# Altium schematic sheet SCH_WINGLET_WIFI.SchDoc: Winglet Wi-Fi
size B; DrawnBy: HCAdam; Organization: Aerospace Village; DocumentNumber: WINGLET; Revision: A; SheetNumber: 6; SheetTotal: 10
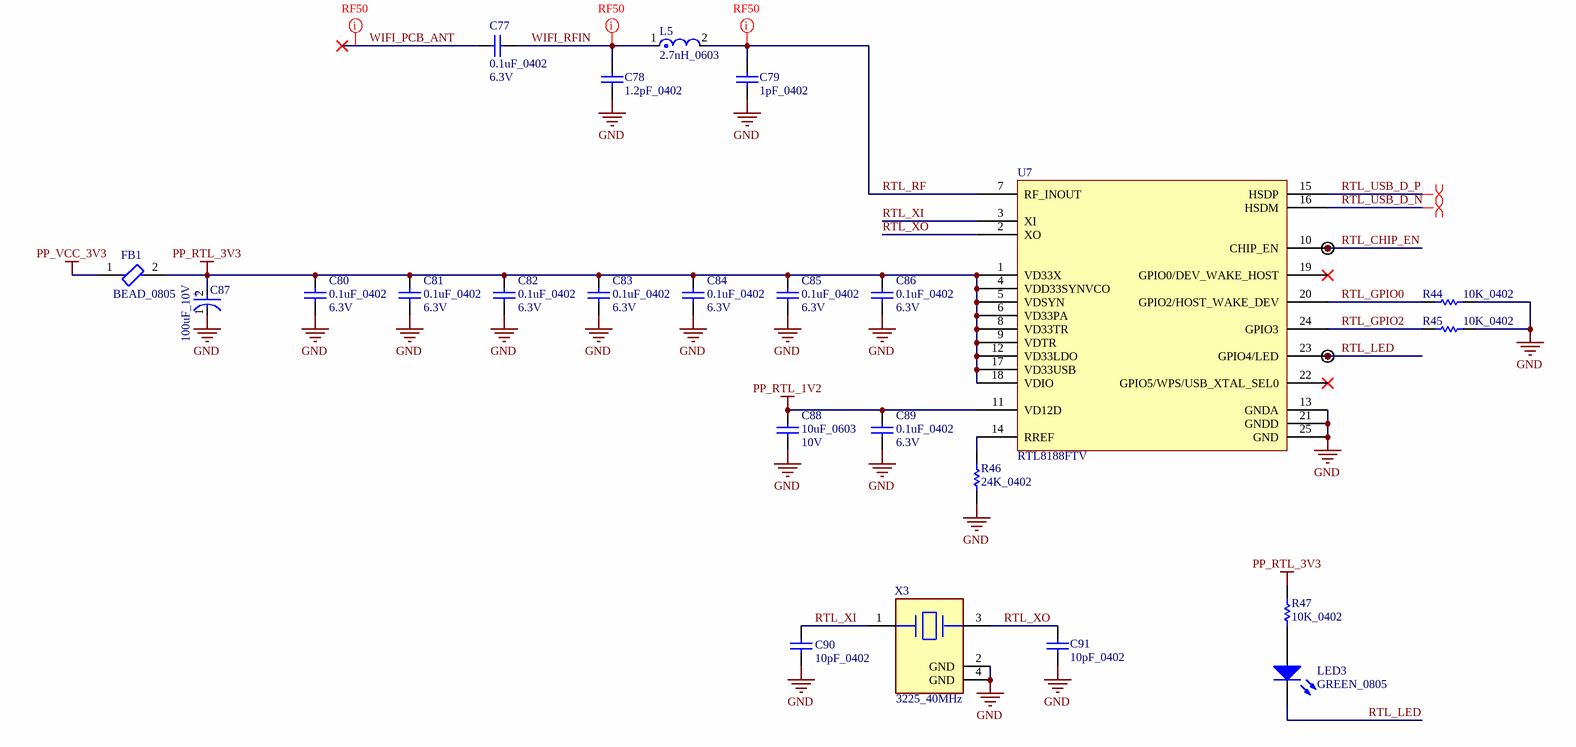
[diagram p0: SCH_WINGLET_WIFI.SchDoc]

## Parts
C77  0.1uF_0402  Voltage Rating: 6.3V  [CAPC1005X56X25NL10T15]
C78  1.2pF_0402  [CAPC1005X61X26NL10T16]
C79  1pF_0402  [CAPC1005X56X25NL10T15]
C80  0.1uF_0402  Voltage Rating: 6.3V  [CAPC1005X56X25NL10T15]
C81  0.1uF_0402  Voltage Rating: 6.3V  [CAPC1005X56X25NL10T15]
C82  0.1uF_0402  Voltage Rating: 6.3V  [CAPC1005X56X25NL10T15]
C83  0.1uF_0402  Voltage Rating: 6.3V  [CAPC1005X56X25NL10T15]
C84  0.1uF_0402  Voltage Rating: 6.3V  [CAPC1005X56X25NL10T15]
C85  0.1uF_0402  Voltage Rating: 6.3V  [CAPC1005X56X25NL10T15]
C86  0.1uF_0402  Voltage Rating: 6.3V  [CAPC1005X56X25NL10T15]
C87  100uF_10V  [FP-TAJB-MFG]
C88  10uF_0603  Voltage Rating: 10V  [CAPC1609X100X15NL20]
C89  0.1uF_0402  Voltage Rating: 6.3V  [CAPC1005X56X25NL10T15]
C90  10pF_0402  [CAPC1006X50X20NL10T10]
C91  10pF_0402  [CAPC1006X50X20NL10T10]
FB1  BEAD_0805  [FP-BLM21-0_2-t0_85-e0_5-IPC_B]
L5  2.7nH_0603  [FP-LQG18HH_00-IPC_B]
LED3  GREEN_0805  [0805_A]
R44  10K_0402  [RESC1005X40X25NL05T05]
R45  10K_0402  [RESC1005X40X25NL05T05]
R46  24K_0402  [RESC1005X40X25NL05T05]
R47  10K_0402  [RESC1005X40X25NL05T05]
TP25  TESTPOINT  [TESTPOINT-0.7MM-SINGLE-LAYER]  (value not drawn)  (no BOM)
TP26  TESTPOINT  [TESTPOINT-0.7MM-SINGLE-LAYER]  (value not drawn)  (no BOM)
U7  RTL8188FTV  [QFN50P400X400X90_HS-25N_RTL]
X3  3225_40MHz  [FP-ABM8-MFG]

## Nets
GND: C78.1 C79.1 C80.1 C81.1 C82.1 C83.1 C84.1 C85.1 C86.1 C87.1(C) C88.1 C89.1 C90.1 C91.1 R44.1 R45.1 R46.1 U7.13(GNDA) U7.21(GNDD) U7.25(GND) X3.2(GND) X3.4(GND)
PP_RTL_1V2: C88.2 C89.2 U7.11(VD12D)
PP_RTL_3V3: C80.2 C81.2 C82.2 C83.2 C84.2 C85.2 C86.2 C87.2(A) FB1.2 R47.1 U7.1(VD33X) U7.4(VDD33SYNVCO) U7.5(VDSYN) U7.6(VD33PA) U7.8(VD33TR) U7.9(VDTR) U7.12(VD33LDO) U7.17(VD33USB) U7.18(VDIO)
PP_VCC_3V3: FB1.1
RTL_CHIP_EN: TP25.1 U7.10(CHIP_EN)
RTL_GPIO0: R44.2 U7.20(GPIO2/HOST_WAKE_DEV)
RTL_GPIO2: R45.2 U7.24(GPIO3)
RTL_LED: LED3.1(K) TP26.1 U7.23(GPIO4/LED)
RTL_RF: C79.2 L5.2 U7.7(RF_INOUT)
RTL_USB_D_N: U7.16(HSDM)
RTL_USB_D_P: U7.15(HSDP)
RTL_XI: C90.2 U7.3(XI) X3.1
RTL_XO: C91.2 U7.2(XO) X3.3
WIFI_PCB_ANT: C77.2
WIFI_RFIN: C77.1 C78.2 L5.1
NetLED3_2: LED3.2(A) R47.2
NetR46_2: R46.2 U7.14(RREF)

Not connected (* = marked no-connect by the designer): U7 19(GPIO0/DEV_WAKE_HOST)* 22(GPIO5/WPS/USB_XTAL_SEL0)*

## Layout directives
differential pair: RTL_USB_D_N, RTL_USB_D_P
net class RF_50Z: RTL_RF, WIFI_PCB_ANT, WIFI_RFIN

## Notes on the sheet
- Title
- Size:
- Date:
- B
- Project:
- Revision:
- Sheet
- of
- Drawn By:
- (in symbol CMP-04424-000366-1) +

## Library data of the parts
C77 C80-C86 C89 = CMP-2008-02743-1: 04026D104KAT2A; Manufacturer: AVX Interconnect / Elco; Part Number: 04026D104KAT2A
C78 = CMP-2008-01995-1: VJ0402D1R0BXCAJ; Manufacturer: Vitramon; Part Number: VJ0402D1R0BXCAJ
C79 = CMP-1034-00084-2: 04025A1R2BAT2A; Manufacturer: AVX Interconnect / Elco; Part Number: 04025A1R2BAT2A
C87 = CMP-04424-000366-1: 100uF 10V ±10% 1.7Ω SMD CASE-B (3528) Tantalum Capacitor; Voltage Rating (DC): 6.3V; ESR (Equivalent Series Resistance): 1.7R; Polarity: Polar; Leakage Current: 6.3uA; Height: 1.9mm; Depth: 2.8mm; Length: 3.5mm; Min Operating Temperature: -55°C; Width: 2.8mm; Series: TAJ; Lead Free: Lead Free; Case/Package: 1210; Voltage: 6.3V; Mount: Surface Mount; Tolerance: 10%; Capacitance: 100uF; Radiation Hardening: No; REACH SVHC: No SVHC; Voltage Rating: 6.3V; Case Code (Metric): 3528; Dissipation Factor: 10%; Packaging: Tape and Reel; Construction: Flat; Features: General Purpose; Max Operating Temperature: 125°C; RoHS Compliant: Yes; Package Quantity: 1; Dielectric Material: Tantalum; Termination: SMD/SMT; Case Code (Imperial): 1210; Height - Seated (Max): 0.083inch
C88 = CMP-2006-00191-1: Part Number: TACL106M006XTA; Manufacturer: AVX Interconnect / Elco
C90 C91 = CMP-2008-04829-1: 0402YJ100FBSTR; Manufacturer: AVX Interconnect / Elco; Part Number: 0402YJ100FBSTR
FB1 = CMP-0686-00717-3: Chip Ferrite Bead, 0805, 150Ω @ 100MHz, 0.09Ω, 25%, 1A; Number of Circuits: 1; Max Current Rating: 800mA; DC Resistance (DCR): 100mR; Shielding: Unshielded; DC Current: 200mA; Impedance: 150R; Contact Plating: Tin; Weight: 0.000194oz; Series: EMIFIL®, BLM21A; Core Material: Ferrite; Test Frequency: 100MHz; Case Code (Metric): 2012; Package Quantity: 4000; Lead Free: Lead Free; Max Operating Temperature: 125°C; Case Code (Imperial): 0805; Material: Ferrite; Min Operating Temperature: -55°C; Tolerance: 25%; Length: 2mm; DC Resistance-Max: 100mR; Width: 1.25mm; RoHS Compliant: Yes; Packaging: Tape and Reel; REACH SVHC: No SVHC; Depth: 1.45mm; Number of Pins: 2; Radiation Hardening: No; Current Rating: 800mA; Height: 0.85mm; Termination: SMD/SMT; Number of Lines: 1; Max DC Current: 200mA; Case/Package: 0805
L5 = CMP-06042-013926-1: Multilayer type RF Inductor 2.7nH ±0.3nH 0.12Ω 1000mA 0603 / LQG18HN2N7S00D; Current Rating: 500mA; DC Resistance (DCR): 150mR; Q Factor: 12; Self Resonant Frequency: 6GHz; Test Frequency: 100MHz; Shielding: Unshielded; Core Material: Air; Mount: Surface Mount; Lead Free: Lead Free; Length: 1.75mm; Inductance: 2.7nH; Case Code (Imperial): 0603; Military Standard: Not; Case Code (Metric): 1608; Max DC Current: 500mA; Min Operating Temperature: -55°C; Depth: 0.95mm; REACH SVHC: No SVHC; Termination: SMD/SMT; Package Quantity: 4000; Number of Pins: 2; Max Operating Temperature: 85°C; Height: 0.8mm; Case/Package: 0603; Width: 0.8mm; Packaging: Tape and Reel; Height - Seated (Max): 0.037inch; DC Current: 500mA; Radiation Hardening: No
LED3 = CMP-1426-00007-1: SMD mono-color Chip LED, WL-SMCW, Green / 150080GS75000; Manufacturer: Wuerth Elektronik; PackageReference: 0805_A; Color: Green; PartNumber: 150080GS75000; ComponentLink2URL: http://katalog.we-online.com/led/datasheet/150080GS75000.pdf; ComponentLink1URL: http://www.we-online.com; ComponentLink1Description: Manufacturer URL; ComponentLink2Description: Datasheet
R44 R45 R47 = CMP-2000-07588-1: Chip Resistor, 10 KOhm, +/- 1%, 0.1 W, -55 to 155 degC, 0402 (1005 Metric), RoHS, Tape and Reel / ERJ2RKF1002X; Manufacturer: Panasonic; Power Rating: 100mW; Voltage Rating: 50V; Resistance: 10KOhm; Case\/Package: 0402; Temperature Coefficient: 100ppm\/degreesC; RoHSCompliant: True; Lead Free: LeadFree; Package Quantity: 1; Contact Plating: Tin; Length: 1mm; Radiation Hardening: No; REACH SVHC: NoSVHC; Max Operating Temperature: 155degC; Depth: 0.5mm; Case Code (Imperial): 0402; Military Standard: Not; Package Description: 2-Pin Surface Mount Device, Body 1 x 0.5 mm; Termination: SMD/SMT; Case Code (Metric): 1005; Height: 0.35mm; Packaging: TapeandReel; Voltage Rating (DC): 50V; Package Reference: 402; Number of Pins: 2; Tolerance: 1%; Mounting Technology: SurfaceMount; Width: 0.02inch; Mount: SurfaceMount; Datasheet URL: https://industrial.panasonic.com/cdbs/www-data/pdf/RDA0000/AOA0000C304.pdf; Composition: ThickFilm; Datasheet Version: 02/2017; Manufacturer URL: http://www.panasonic.com/; Max Power Dissipation: 100mW; Number of Terminations: 2; Min Operating Temperature: -55degC
R46 = CMP-2000-07588-1: Manufacturer: Panasonic; Power Rating: 100mW; Voltage Rating: 50V; Resistance: 24KOhm; Tolerance: 1%; Case\/Package: 0402; Temperature Coefficient: 100ppm\/degreesC; RoHSCompliant: True; Lead Free: LeadFree; Package Quantity: 1; Contact Plating: Tin; Length: 1mm; Radiation Hardening: No; REACH SVHC: NoSVHC; Max Operating Temperature: 155degC; Depth: 0.5mm; Case Code (Imperial): 0402; Military Standard: Not; Package Description: 2-Pin Surface Mount Device, Body 1 x 0.5 mm; Termination: SMD/SMT; Case Code (Metric): 1005; Height: 0.35mm; Packaging: TapeandReel; Voltage Rating (DC): 50V; Package Reference: 402; Number of Pins: 2; Mounting Technology: SurfaceMount; Width: 0.02inch; Mount: SurfaceMount; Datasheet URL: https://industrial.panasonic.com/cdbs/www-data/pdf/RDA0000/AOA0000C304.pdf; Composition: ThickFilm; Datasheet Version: 02/2017; Manufacturer URL: http://www.panasonic.com/; Max Power Dissipation: 100mW; Number of Terminations: 2; Min Operating Temperature: -55degC
TP25 TP26 = TP_07: TESTPOINT SINGLE LAYER 0.7MM; AEC-Q: Yes; PPAP: Unknown; Selective Soldering: No; Value: Unknown; RoHS: Yes; Package: BOARD_FEATURE; Washable: Yes; Mounting: Unknown
U7 = RTL8188FTV: Single-chip IEEE 812.11b/g/n 1T1R WLAN
X3 = CMP-27762-008947-1: Crystal 40MHz ±10ppm 10pF SMD-4 3.2mm x 2.5mm / ABM8-40.000MHZ-10-1-U-T; ESR (Equivalent Series Resistance): 35R; Frequency: 40MHz; Number of Pins: 4; Frequency Stability: 10ppm; Radiation Hardening: No; Tolerance: 10ppm; Min Operating Temperature: -10°C; Resistor Type: Ceramic; Width: 0.098inch; Max Operating Temperature: 60°C; Case/Package: SMD/SMT; Packaging: Tape and Reel; Mount: Surface Mount; Termination: SMD/SMT; Load Capacitance: 10pF; Series: ABM8; Height: 0.031inch; Frequency Tolerance: 10ppm; Operating Frequency: 40 MHz; Package Quantity: 1000; Length: 0.126inch; Lead Free: Lead Free